# Altium schematic sheet ui-pcb.SchDoc
size A4; SheetNumber: 1; SheetTotal: 8
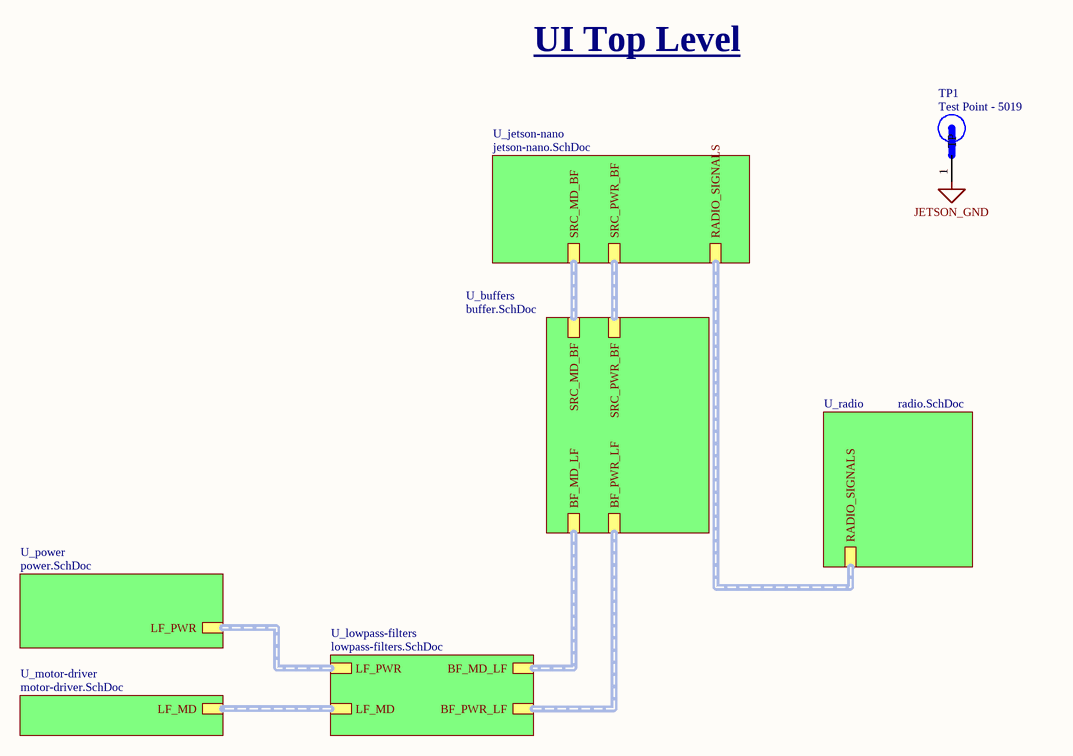
[diagram p0: ui-pcb.SchDoc]

## Parts
TP1  Test Point - 5019  [TP380X203]

## Sub-sheets
U_buffers = buffer.SchDoc: SRC_MD_BF (harness MD_SIGNALS), SRC_PWR_BF (harness PWR_SIGNALS), BF_MD_LF (harness MD_SIGNALS), BF_PWR_LF (harness PWR_SIGNALS)
U_jetson-nano = jetson-nano.SchDoc: SRC_PWR_BF (harness PWR_SIGNALS), SRC_MD_BF (harness MD_SIGNALS), RADIO_SIGNALS (harness RADIO_SIGNALS)
U_lowpass-filters = lowpass-filters.SchDoc: BF_PWR_LF (harness PWR_SIGNALS), LF_PWR (harness PWR_SIGNALS), BF_MD_LF (harness MD_SIGNALS), LF_MD (harness MD_SIGNALS)
U_motor-driver = motor-driver.SchDoc: LF_MD (harness MD_SIGNALS)
U_power = power.SchDoc: LF_PWR (harness PWR_SIGNALS)
U_radio = radio.SchDoc: RADIO_SIGNALS (harness RADIO_SIGNALS)

## Nets
JETSON_GND: TP1.1(TP)

## Buses and harness runs
harness sheet U_buffers/BF_MD_LF = sheet U_lowpass-filters/BF_MD_LF
harness sheet U_buffers/BF_PWR_LF = sheet U_lowpass-filters/BF_PWR_LF
harness sheet U_buffers/SRC_MD_BF = sheet U_jetson-nano/SRC_MD_BF
harness sheet U_buffers/SRC_PWR_BF = sheet U_jetson-nano/SRC_PWR_BF
harness sheet U_jetson-nano/RADIO_SIGNALS = sheet U_radio/RADIO_SIGNALS
harness sheet U_lowpass-filters/LF_MD = sheet U_motor-driver/LF_MD
harness sheet U_lowpass-filters/LF_PWR = sheet U_power/LF_PWR

## Notes on the sheet
- UI Top Level

## Library data of the parts
TP1 = Test Point - 5019: PC Test Point, Miniature Phosphor Bronze, Silver Plating Surface Mount Mounting Type; MP: 5019; MF: Keystone Electronics; Value: *; Package: 2010 Keystone; Part Number: Test Point - 5019